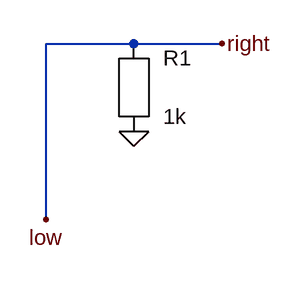
[diagram p0: schematic two_labels_corner.asc]
two_labels_corner.asc, the LTspice schematic file:
Version 4
SHEET 1 880 680
WIRE 0 0 192 0
WIRE 0 0 0 192
SYMBOL res 96 48 R0
SYMATTR InstName R1
SYMATTR Value 1k
FLAG 96 96 0
FLAG 192 0 right
FLAG 0 192 low

The netlist it stands for:
* two_labels_corner.asc
R1 low 0 1k
.backanno
.end